# Altium schematic sheet LTC6813_Slave.SchDoc
size 482 x 304 mm; SheetNumber: 1; SheetTotal: 1
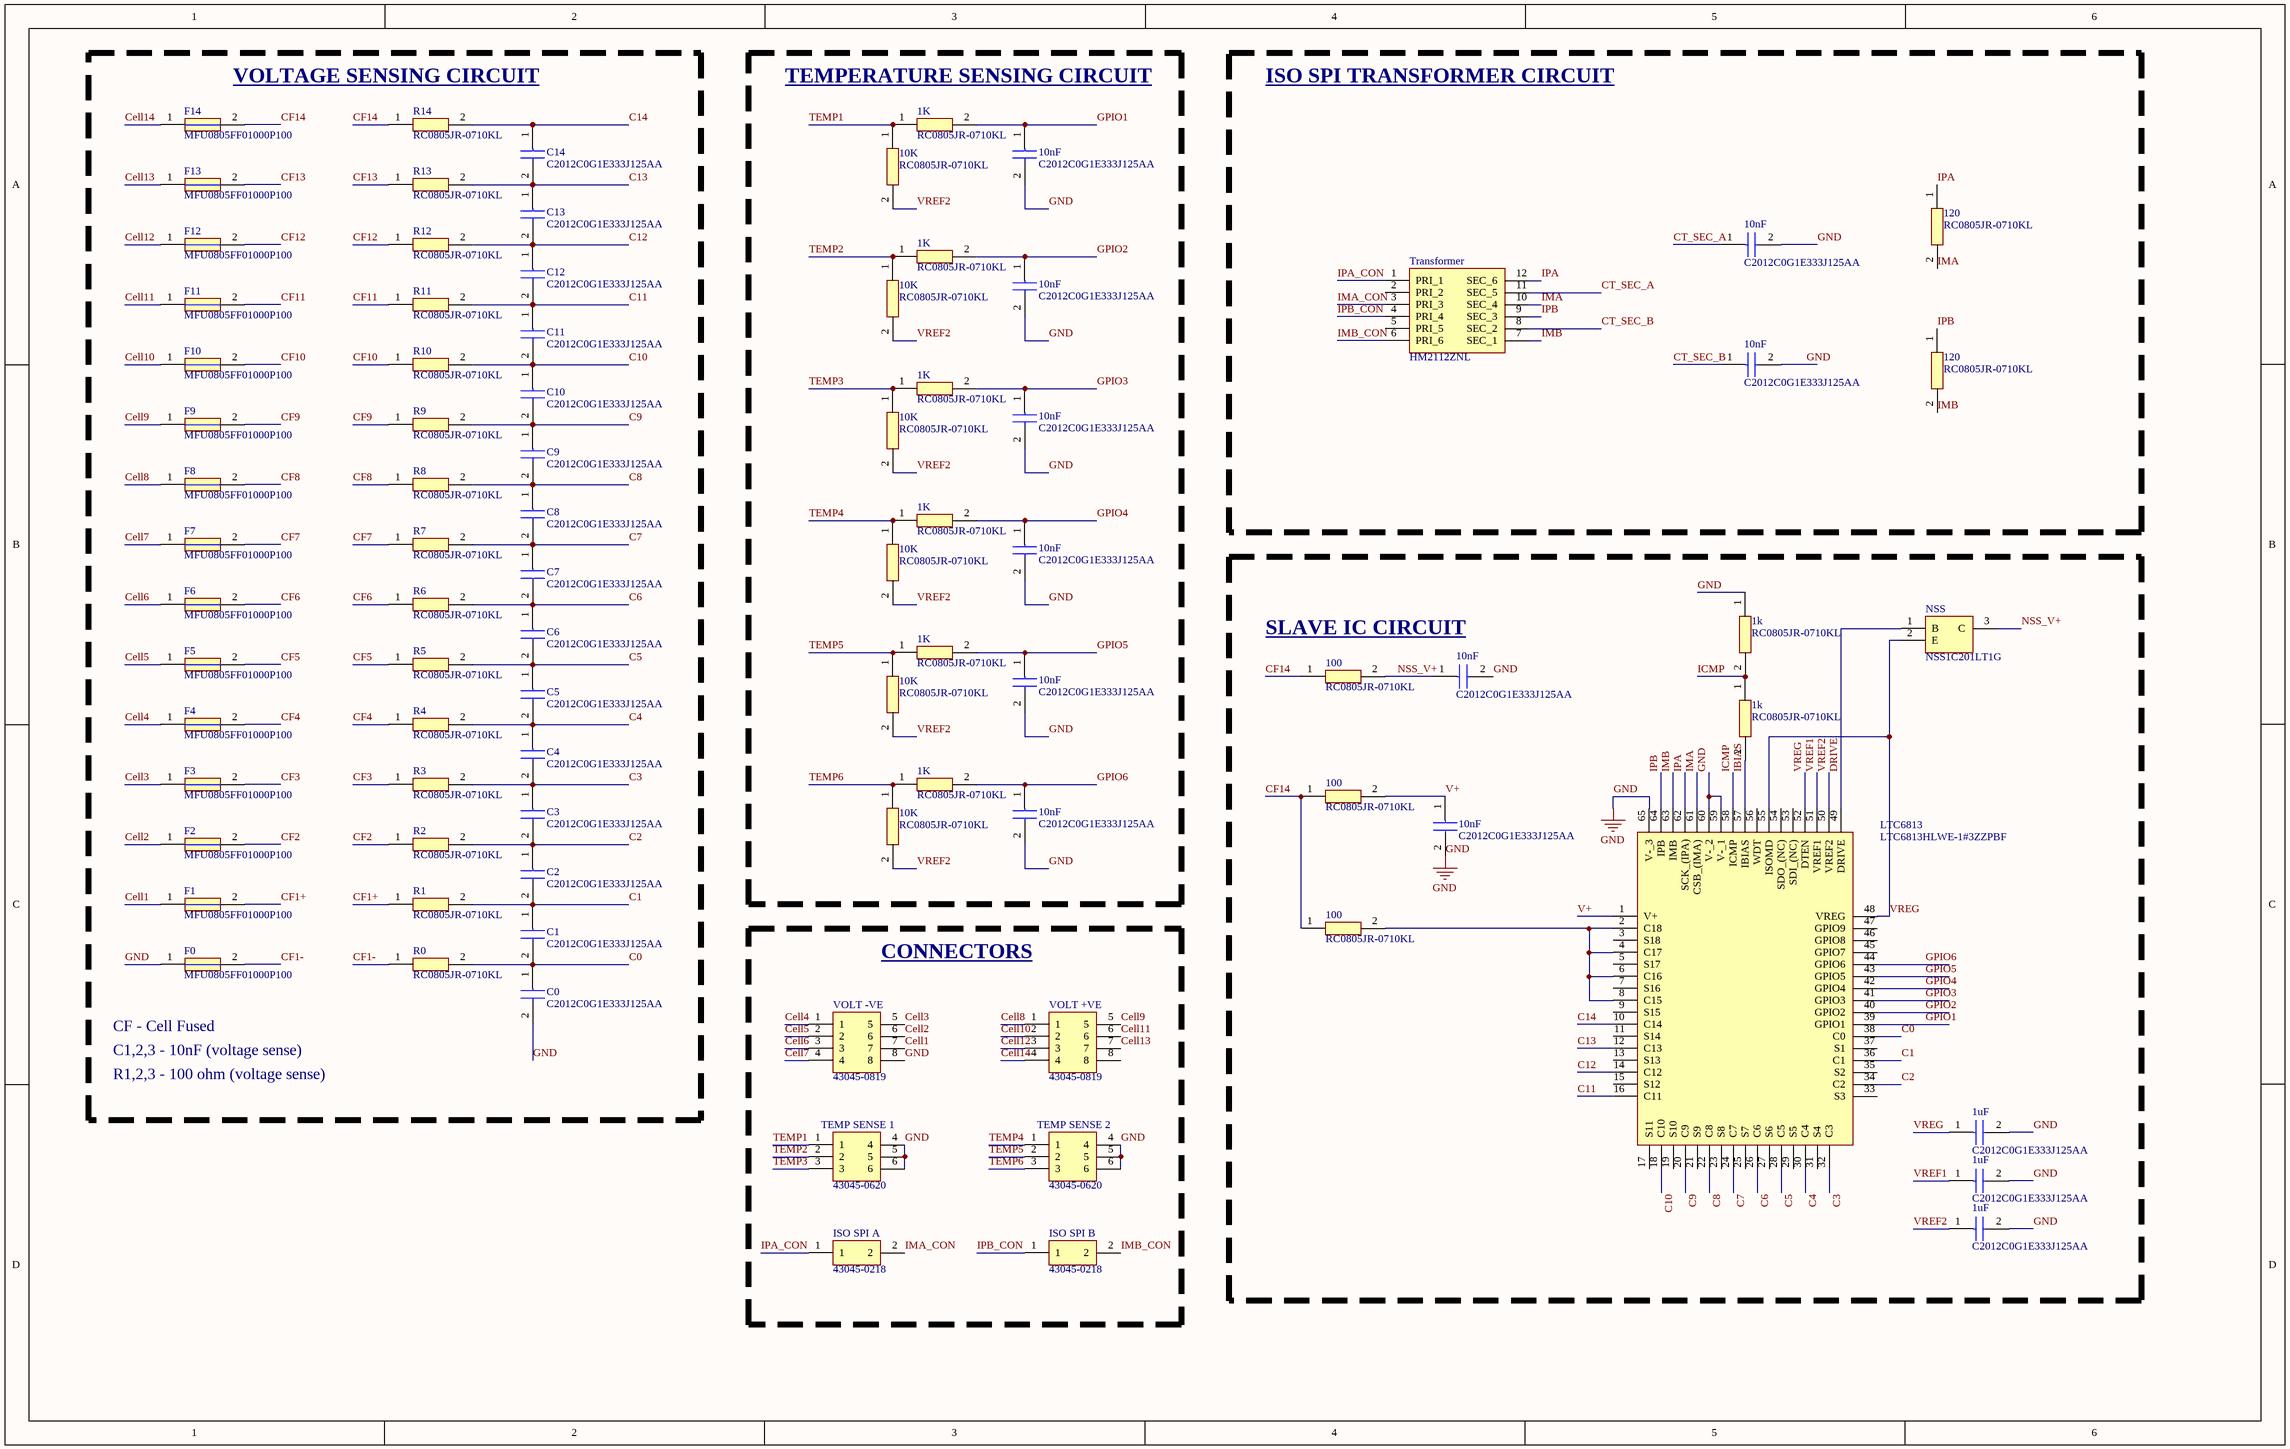
[diagram p0: LTC6813_Slave.SchDoc]

## Parts
(Parts that share a designator on the sheet are numbered #1, #2 ... from top to bottom, then left to right.)
1K#1  RC0805JR-0710KL  [RESC2012X60N]
1K#2  RC0805JR-0710KL  [RESC2012X60N]
1K#3  RC0805JR-0710KL  [RESC2012X60N]
1K#4  RC0805JR-0710KL  [RESC2012X60N]
1k#5  RC0805JR-0710KL  [RESC2012X60N]
1K#6  RC0805JR-0710KL  [RESC2012X60N]
1k#7  RC0805JR-0710KL  [RESC2012X60N]
1K#8  RC0805JR-0710KL  [RESC2012X60N]
1uF#1  C2012C0G1E333J125AA  [C2012_Commercial]
1uF#2  C2012C0G1E333J125AA  [C2012_Commercial]
1uF#3  C2012C0G1E333J125AA  [C2012_Commercial]
10K#1  RC0805JR-0710KL  [RESC2012X60N]
10K#2  RC0805JR-0710KL  [RESC2012X60N]
10K#3  RC0805JR-0710KL  [RESC2012X60N]
10K#4  RC0805JR-0710KL  [RESC2012X60N]
10K#5  RC0805JR-0710KL  [RESC2012X60N]
10K#6  RC0805JR-0710KL  [RESC2012X60N]
10nF#1  C2012C0G1E333J125AA  [C2012_Commercial]
10nF#2  C2012C0G1E333J125AA  [C2012_Commercial]
10nF#3  C2012C0G1E333J125AA  [C2012_Commercial]
10nF#4  C2012C0G1E333J125AA  [C2012_Commercial]
10nF#5  C2012C0G1E333J125AA  [C2012_Commercial]
10nF#6  C2012C0G1E333J125AA  [C2012_Commercial]
10nF#7  C2012C0G1E333J125AA  [C2012_Commercial]
10nF#8  C2012C0G1E333J125AA  [C2012_Commercial]
10nF#9  C2012C0G1E333J125AA  [C2012_Commercial]
10nF#10  C2012C0G1E333J125AA  [C2012_Commercial]
100#1  RC0805JR-0710KL  [RESC2012X60N]
100#2  RC0805JR-0710KL  [RESC2012X60N]
100#3  RC0805JR-0710KL  [RESC2012X60N]
120#1  RC0805JR-0710KL  [RESC2012X60N]
120#2  RC0805JR-0710KL  [RESC2012X60N]
C0  C2012C0G1E333J125AA  [C2012_Commercial]
C1  C2012C0G1E333J125AA  [C2012_Commercial]
C2  C2012C0G1E333J125AA  [C2012_Commercial]
C3  C2012C0G1E333J125AA  [C2012_Commercial]
C4  C2012C0G1E333J125AA  [C2012_Commercial]
C5  C2012C0G1E333J125AA  [C2012_Commercial]
C6  C2012C0G1E333J125AA  [C2012_Commercial]
C7  C2012C0G1E333J125AA  [C2012_Commercial]
C8  C2012C0G1E333J125AA  [C2012_Commercial]
C9  C2012C0G1E333J125AA  [C2012_Commercial]
C10  C2012C0G1E333J125AA  [C2012_Commercial]
C11  C2012C0G1E333J125AA  [C2012_Commercial]
C12  C2012C0G1E333J125AA  [C2012_Commercial]
C13  C2012C0G1E333J125AA  [C2012_Commercial]
C14  C2012C0G1E333J125AA  [C2012_Commercial]
F0  MFU0805FF01000P100  [FUSC2012X55N]
F1  MFU0805FF01000P100  [FUSC2012X55N]
F2  MFU0805FF01000P100  [FUSC2012X55N]
F3  MFU0805FF01000P100  [FUSC2012X55N]
F4  MFU0805FF01000P100  [FUSC2012X55N]
F5  MFU0805FF01000P100  [FUSC2012X55N]
F6  MFU0805FF01000P100  [FUSC2012X55N]
F7  MFU0805FF01000P100  [FUSC2012X55N]
F8  MFU0805FF01000P100  [FUSC2012X55N]
F9  MFU0805FF01000P100  [FUSC2012X55N]
F10  MFU0805FF01000P100  [FUSC2012X55N]
F11  MFU0805FF01000P100  [FUSC2012X55N]
F12  MFU0805FF01000P100  [FUSC2012X55N]
F13  MFU0805FF01000P100  [FUSC2012X55N]
F14  MFU0805FF01000P100  [FUSC2012X55N]
ISO_SPI_A  43045-0218  [43045-02YY_181920]
ISO_SPI_B  43045-0218  [43045-02YY_181920]
LTC6813  LTC6813HLWE-1#3ZZPBF  [QFP50P1200X1200X160-65N]
NSS  NSS1C201LT1G  [SOT96P237X111-3N]
R0  RC0805JR-0710KL  [RESC2012X60N]
R1  RC0805JR-0710KL  [RESC2012X60N]
R2  RC0805JR-0710KL  [RESC2012X60N]
R3  RC0805JR-0710KL  [RESC2012X60N]
R4  RC0805JR-0710KL  [RESC2012X60N]
R5  RC0805JR-0710KL  [RESC2012X60N]
R6  RC0805JR-0710KL  [RESC2012X60N]
R7  RC0805JR-0710KL  [RESC2012X60N]
R8  RC0805JR-0710KL  [RESC2012X60N]
R9  RC0805JR-0710KL  [RESC2012X60N]
R10  RC0805JR-0710KL  [RESC2012X60N]
R11  RC0805JR-0710KL  [RESC2012X60N]
R12  RC0805JR-0710KL  [RESC2012X60N]
R13  RC0805JR-0710KL  [RESC2012X60N]
R14  RC0805JR-0710KL  [RESC2012X60N]
TEMP_SENSE_1  43045-0620  [43045-06YY_181920]
TEMP_SENSE_2  43045-0620  [43045-06YY_181920]
Transformer  HM2112ZNL  [SOP200P1543X320-12N]
VOLT_+VE  43045-0819  [43045-08YY_181920]
VOLT_-VE  43045-0819  [43045-08YY_181920]

## Blocks framed on the sheet
VOLTAGE SENSING CIRCUIT: C0-C14 F0-F14 R0-R14
TEMPERATURE SENSING CIRCUIT: 1K#1-1K#4 1K#6 1K#8 10K#1-10K#6 10nF#1 10nF#3 10nF#5-10nF#7 10nF#9
ISO SPI TRANSFORMER CIRCUIT: 10nF#2 10nF#4 120#1 120#2 Transformer
SLAVE IC CIRCUIT: 1k#5 1k#7 1uF#1-1uF#3 10nF#8 10nF#10 100#1-100#3 LTC6813 NSS
CONNECTORS: ISO_SPI_A ISO_SPI_B TEMP_SENSE_1 TEMP_SENSE_2 VOLT_+VE VOLT_-VE

## Nets
GND: 1k#5.1 1uF#1.2 1uF#2.2 1uF#3.2 10nF#1.2 10nF#2.2 10nF#3.2 10nF#4.2 10nF#5.2 10nF#6.2 10nF#7.2 10nF#8.2 10nF#9.2 10nF#10.2 C0.2 F0.1 LTC6813.59(V-_1) LTC6813.60(V-_2) LTC6813.65(V-_3) TEMP_SENSE_1.4 TEMP_SENSE_1.5 TEMP_SENSE_1.6 TEMP_SENSE_2.4 TEMP_SENSE_2.5 TEMP_SENSE_2.6 VOLT_-VE.8
C0: C0.1 C1.2 LTC6813.38(C0) R0.2
C1: C1.1 C2.2 LTC6813.36(C1) R1.2
C2: C2.1 C3.2 LTC6813.34(C2) R2.2
C3: C3.1 C4.2 LTC6813.32(C3) R3.2
C4: C4.1 C5.2 LTC6813.30(C4) R4.2
C5: C5.1 C6.2 LTC6813.28(C5) R5.2
C6: C6.1 C7.2 LTC6813.26(C6) R6.2
C7: C7.1 C8.2 LTC6813.24(C7) R7.2
C8: C8.1 C9.2 LTC6813.22(C8) R8.2
C9: C9.1 C10.2 LTC6813.20(C9) R9.2
C10: C10.1 C11.2 LTC6813.18(C10) R10.2
C11: C11.1 C12.2 LTC6813.16(C11) R11.2
C12: C12.1 C13.2 LTC6813.14(C12) R12.2
C13: C13.1 C14.2 LTC6813.12(C13) R13.2
C14: C14.1 LTC6813.10(C14) R14.2
Cell1: F1.1 VOLT_-VE.7
Cell2: F2.1 VOLT_-VE.6
Cell3: F3.1 VOLT_-VE.5
Cell4: F4.1 VOLT_-VE.1
Cell5: F5.1 VOLT_-VE.2
Cell6: F6.1 VOLT_-VE.3
Cell7: F7.1 VOLT_-VE.4
Cell8: F8.1 VOLT_+VE.1
Cell9: F9.1 VOLT_+VE.5
Cell10: F10.1 VOLT_+VE.2
Cell11: F11.1 VOLT_+VE.6
Cell12: F12.1 VOLT_+VE.3
Cell13: F13.1 VOLT_+VE.7
Cell14: F14.1 VOLT_+VE.4
CF1+: F1.2 R1.1
CF1-: F0.2 R0.1
CF2: F2.2 R2.1
CF3: F3.2 R3.1
CF4: F4.2 R4.1
CF5: F5.2 R5.1
CF6: F6.2 R6.1
CF7: F7.2 R7.1
CF8: F8.2 R8.1
CF9: F9.2 R9.1
CF10: F10.2 R10.1
CF11: F11.2 R11.1
CF12: F12.2 R12.1
CF13: F13.2 R13.1
CF14: 100#1.1 100#2.1 100#3.1 F14.2 R14.1
CT_SEC_A: 10nF#2.1 Transformer.11(SEC_5)
CT_SEC_B: 10nF#4.1 Transformer.8(SEC_2)
DRIVE: LTC6813.49(DRIVE) NSS.1(B)
GPIO1: 1K#1.2 10nF#1.1 LTC6813.39(GPIO1)
GPIO2: 1K#2.2 10nF#3.1 LTC6813.40(GPIO2)
GPIO3: 1K#3.2 10nF#5.1 LTC6813.41(GPIO3)
GPIO4: 1K#4.2 10nF#6.1 LTC6813.42(GPIO4)
GPIO5: 1K#6.2 10nF#7.1 LTC6813.43(GPIO5)
GPIO6: 1K#8.2 10nF#9.1 LTC6813.44(GPIO6)
IBIAS: 1k#7.2 LTC6813.57(IBIAS)
ICMP: 1k#5.2 1k#7.1 LTC6813.58(ICMP)
IMA: 120#1.2 LTC6813.61(CSB_(IMA)) Transformer.10(SEC_4)
IMA_CON: ISO_SPI_A.2 Transformer.3(PRI_3)
IMB: 120#2.2 LTC6813.63(IMB) Transformer.7(SEC_1)
IMB_CON: ISO_SPI_B.2 Transformer.6(PRI_6)
IPA: 120#1.1 LTC6813.62(SCK_(IPA)) Transformer.12(SEC_6)
IPA_CON: ISO_SPI_A.1 Transformer.1(PRI_1)
IPB: 120#2.1 LTC6813.64(IPB) Transformer.9(SEC_3)
IPB_CON: ISO_SPI_B.1 Transformer.4(PRI_4)
NSS_V+: 10nF#8.1 100#1.2 NSS.3(C)
TEMP1: 1K#1.1 10K#1.1 TEMP_SENSE_1.1
TEMP2: 1K#2.1 10K#2.1 TEMP_SENSE_1.2
TEMP3: 1K#3.1 10K#3.1 TEMP_SENSE_1.3
TEMP4: 1K#4.1 10K#4.1 TEMP_SENSE_2.1
TEMP5: 1K#6.1 10K#5.1 TEMP_SENSE_2.2
TEMP6: 1K#8.1 10K#6.1 TEMP_SENSE_2.3
V+: 10nF#10.1 100#2.2 LTC6813.1(V+)
VREF1: 1uF#2.1 LTC6813.51(VREF1)
VREF2: 1uF#3.1 10K#1.2 10K#2.2 10K#3.2 10K#4.2 10K#5.2 10K#6.2 LTC6813.50(VREF2)
VREG: 1uF#1.1 LTC6813.48(VREG) LTC6813.52(DTEN) LTC6813.55(ISOMD) NSS.2(E)
Net100#3_2: 100#3.2 LTC6813.2(C18) LTC6813.4(C17) LTC6813.6(C16) LTC6813.8(C15)

Not connected (* = marked no-connect by the designer): LTC6813 3(S18) 5(S17) 7(S16) 9(S15) 11(S14) 13(S13) 15(S12) 17(S11) 19(S10) 21(S9) 23(S8) 25(S7) 27(S6) 29(S5) 31(S4) 33(S3) 35(S2) 37(S1) 45(GPIO7) 46(GPIO8) 47(GPIO9) 53(SDI_(NC)) 54(SDO_(NC)) 56(WDT); Transformer 2(PRI_2) 5(PRI_5); VOLT_+VE 8

## Notes on the sheet
- CF - Cell Fused
- C1,2,3 - 10nF (voltage sense)
- R1,2,3 - 100 ohm (voltage sense)

## Library data of the parts
1K#1-1K#4 1k#5 1K#6 1k#7 1K#8 10K#1-10K#6 100#1-100#3 120#1 120#2 R0-R14 = RC0805JR-0710KL: Resistor; Manufacturer_Name: KEMET; Datasheet Link: https://datasheet.datasheetarchive.com/originals/distributors/Datasheets_SAMA/902f9e387b938f871d31120f5fc1d65e.pdf; Height: 0.6mm; Manufacturer_Part_Number: RC0805JR-0710KL; Mouser Part Number: 603-RC0805JR-0710KL; Mouser Price/Stock: https://www.mouser.co.uk/ProductDetail/YAGEO/RC0805JR-0710KL?qs=ZFGQJeMQzF5q%2Fp77vM%2FrVQ%3D%3D; Arrow Part Number: RC0805JR-0710KL; Arrow Price/Stock: https://www.arrow.com/en/products/rc0805jr-0710kl/yageo
1uF#1-1uF#3 10nF#1-10nF#10 C0-C14 = C2012C0G1E333J125AA: Capacitor; Manufacturer_Name: TDK; Datasheet Link: https://product.tdk.com/system/files/dam/doc/product/capacitor/ceramic/mlcc/catalog/mlcc_commercial_general_en.pdf; Height: 0.75mm; Manufacturer_Part_Number: C2012C0G1E333J125AA; Mouser Part Number: 810-C2012C0G1E333J; Mouser Price/Stock: https://www.mouser.co.uk/ProductDetail/TDK/C2012C0G1E333J125AA?qs=NRhsANhppD9YN6415mAquQ%3D%3D; Arrow Part Number: C2012C0G1E333J125AA; Arrow Price/Stock: https://www.arrow.com/en/products/c2012c0g1e333j125aa/tdk
F0-F14 = MFU0805FF01000P100: Fuse; Manufacturer_Name: Vishay; Datasheet Link: https://mouser.componentsearchengine.com/Datasheets/1/MFU0805FF01000P100.pdf; Height: 0.55mm; Manufacturer_Part_Number: MFU0805FF01000P100; Mouser Part Number: 594-MFU0805FF01000P1; Mouser Price/Stock: https://www.mouser.co.uk/ProductDetail/Vishay-Beyschlag/MFU0805FF01000P100?qs=LqRyH8pEnDjDHmrJUWI99w%3D%3D; Arrow Part Number: MFU0805FF01000P100; Arrow Price/Stock: https://www.arrow.com/en/products/mfu0805ff01000p100/vishay?region=nac
ISO_SPI_A ISO_SPI_B = 43045-0218: Connector; Manufacturer_Name: Molex; Datasheet Link: https://www.molex.com/pdm_docs/sd/430450218_sd.pdf; Height: 9.91mm; Manufacturer_Part_Number: 43045-0218; Mouser Part Number: 538-43045-0218; Mouser Price/Stock: https://www.mouser.co.uk/ProductDetail/Molex/43045-0218?qs=4XSMV6Twtb2qUKINalLbdA%3D%3D; Arrow Part Number: 43045-0218; Arrow Price/Stock: https://www.arrow.com/en/products/43045-0218/molex
LTC6813 = LTC6813HLWE-1#3ZZPBF: Integrated Circuit; Manufacturer_Name: Analog Devices; Datasheet Link: https://www.analog.com/media/en/technical-documentation/data-sheets/LTC6813-1.pdf; Height: 1.6mm; Manufacturer_Part_Number: LTC6813HLWE-1#3ZZPBF; Mouser Part Number: 584-6813HLWE13ZZPBF; Mouser Price/Stock: https://www.mouser.co.uk/ProductDetail/Analog-Devices-Linear-Technology/LTC6813HLWE-13ZZPBF?qs=lYGu3FyN48e3Qu9IYnRGuQ%3D%3D; Arrow Part Number: LTC6813HLWE-1#3ZZPBF; Arrow Price/Stock: https://www.arrow.com/en/products/ltc6813hlwe-13zzpbf/linear-technology
NSS = NSS1C201LT1G: Integrated Circuit; Manufacturer_Name: onsemi; Datasheet Link: https://www.arrow.com/en/products/nss1c201lt1g/on-semiconductor?region=nac; Height: 1.11mm; Manufacturer_Part_Number: NSS1C201LT1G; Mouser Part Number: 863-NSS1C201LT1G; Mouser Price/Stock: https://www.mouser.co.uk/ProductDetail/onsemi/NSS1C201LT1G?qs=N5dOQkml4H%252BCR%252BG2EuQ5hA%3D%3D; Arrow Part Number: NSS1C201LT1G; Arrow Price/Stock: https://www.arrow.com/en/products/nss1c201lt1g/on-semiconductor?region=nac
TEMP_SENSE_1 TEMP_SENSE_2 = 43045-0620: Connector; Manufacturer_Name: Molex; Datasheet Link: https://www.molex.com/pdm_docs/sd/430450218_sd.pdf; Height: 9.91mm; Manufacturer_Part_Number: 43045-0620; Mouser Part Number: 538-43045-0620; Mouser Price/Stock: https://www.mouser.co.uk/ProductDetail/Molex/43045-0620?qs=mrPiglD9aYJhVB0xc7lbqQ%3D%3D; Arrow Part Number: 43045-0620; Arrow Price/Stock: https://www.arrow.com/en/products/43045-0620/molex
Transformer = HM2112ZNL: Transformer; Manufacturer_Name: Pulse; Datasheet Link: https://productfinder.pulseeng.com/doc_type/WEB301/doc_num/HM2112ZNL/doc_part/HM2112ZNL.pdf; Height: 3.2mm; Manufacturer_Part_Number: HM2112ZNL; Mouser Part Number: 673-HM2112ZNL; Mouser Price/Stock: https://www.mouser.co.uk/ProductDetail/Pulse-Electronics/HM2112ZNL/?qs=chTDxNqvsylLr1OAY8rM9g%3D%3D; Arrow Part Number: HM2112ZNL; Arrow Price/Stock: https://www.arrow.com/en/products/hm2112znl/pulse-electronics-corporation
VOLT_+VE VOLT_-VE = 43045-0819: Connector; Manufacturer_Name: Molex; Datasheet Link: https://www.molex.com/pdm_docs/sd/430450218_sd.pdf; Height: 9.91mm; Manufacturer_Part_Number: 43045-0819; Mouser Part Number: 538-43045-0819; Mouser Price/Stock: https://www.mouser.co.uk/ProductDetail/Molex/43045-0819?qs=6RXNyJqNVR7Wg0o6pQawlw%3D%3D; Arrow Part Number: 43045-0819; Arrow Price/Stock: https://www.arrow.com/en/products/43045-0819/molex?region=nac